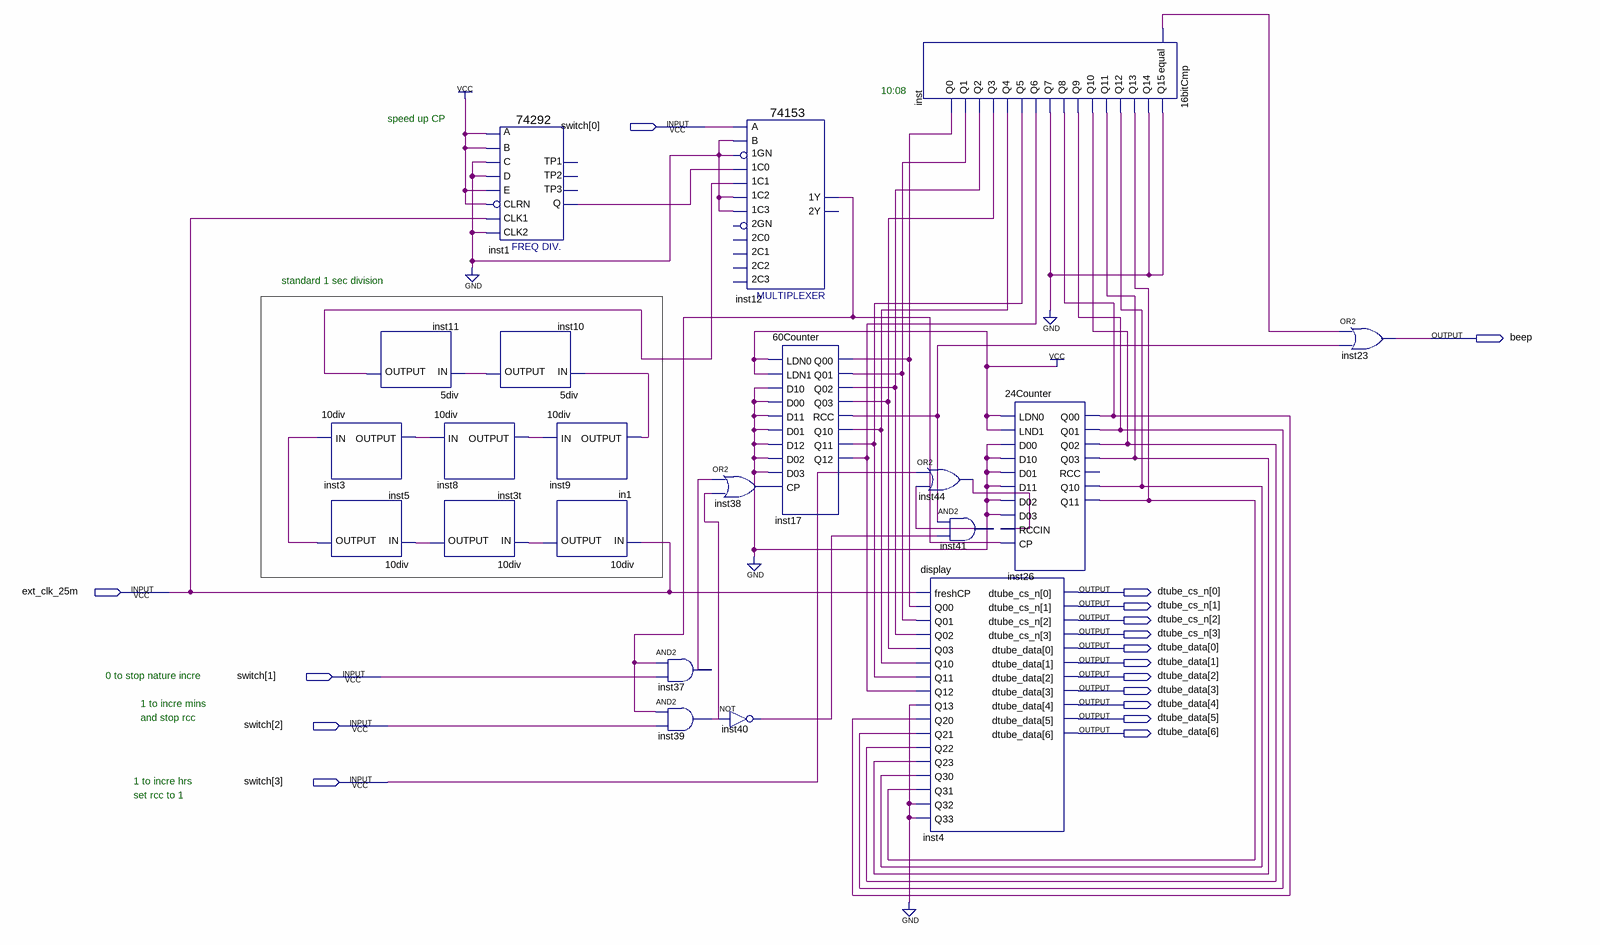
[diagram p0: schematic sheet]
// Quartus schematic alertDesign.bdf as structural Verilog: 21 symbols, 17 pins
module alertDesign (
  input  [3:0] switch,
  input  ext_clk_25m,
  output beep,
  output [3:0] dtube_cs_n,
  output [6:0] dtube_data
);

  wire in1_output, inst1_q, inst3_output, inst3t_output, inst5_output, inst8_output, inst9_output,
       inst10_output, inst11_output, inst12_1y, inst17_q00, inst17_q01, inst17_q02, inst17_q03, inst17_q10,
       inst17_q11, inst17_q12, inst17_rcc, inst26_q00, inst26_q01, inst26_q02, inst26_q03, inst26_q10,
       inst26_q11, inst37_out, inst38_out, inst39_out, inst40_out, inst41_out, inst44_out, inst_equal;

  \10div  inst3 (.IN(inst5_output), .OUTPUT(inst3_output));
  \10div  inst5 (.IN(inst3t_output), .OUTPUT(inst5_output));
  \5div  inst11 (.IN(inst10_output), .OUTPUT(inst11_output));
  \10div  inst8 (.IN(inst3_output), .OUTPUT(inst8_output));
  \10div  inst3t (.IN(in1_output), .OUTPUT(inst3t_output));
  \74292  inst1 (
    .A(1'b1), .D(1'b0), .C(1'b0), .B(1'b1), .CLK1(ext_clk_25m), .CLRN(1'b1), .E(1'b1), .CLK2(1'b0),
    .Q(inst1_q));  // open: TP2, TP1, TP3
  \5div  inst10 (.IN(inst9_output), .OUTPUT(inst10_output));
  \10div  inst9 (.IN(inst8_output), .OUTPUT(inst9_output));
  \10div  in1 (.IN(ext_clk_25m), .OUTPUT(in1_output));
  and inst37 (inst37_out, inst12_1y, switch[1]);
  and inst39 (inst39_out, inst12_1y, switch[2]);
  or inst38 (inst38_out, inst37_out, inst39_out);
  not inst40 (inst40_out, inst39_out);
  \74153  inst12 (
    .\1C1 (inst11_output), .\1GN (1'b0), .\1C0 (inst1_q), .\1C2 (1'b0), .\1C3 (1'b0), .B(1'b0),
    .A(switch[0]), .\1Y (inst12_1y));  // open: 2C0, 2GN, 2C2, 2C1, 2C3, 2Y
  \60Counter  inst17 (
    .LDN0(1'b1), .LDN1(1'b1), .D10(1'b0), .D00(1'b0), .D11(1'b0), .D01(1'b0), .D12(1'b0), .D02(1'b0),
    .D03(1'b0), .CP(inst38_out), .Q00(inst17_q00), .Q01(inst17_q01), .Q02(inst17_q02), .Q03(inst17_q03),
    .RCC(inst17_rcc), .Q10(inst17_q10), .Q11(inst17_q11), .Q12(inst17_q12));
  \16bitCmp  inst (
    .Q15(1'b0), .Q14(1'b0), .Q13(inst26_q11), .Q12(inst26_q10), .Q11(inst26_q03), .Q10(inst26_q02),
    .Q9(inst26_q01), .Q8(inst26_q00), .Q7(1'b0), .Q6(inst17_q12), .Q5(inst17_q11), .Q4(inst17_q10),
    .Q3(inst17_q03), .Q2(inst17_q02), .Q1(inst17_q01), .Q0(inst17_q00), .equal(inst_equal));
  or inst44 (inst44_out, switch[3], inst41_out);
  and inst41 (inst41_out, inst17_rcc, inst40_out);
  display inst4 (
    .freshCP(ext_clk_25m), .Q00(inst17_q00), .Q01(inst17_q01), .Q02(inst17_q02), .Q03(inst17_q03),
    .Q10(inst17_q10), .Q11(inst17_q11), .Q12(inst17_q12), .Q13(1'b0), .Q20(inst26_q00), .Q21(inst26_q01),
    .Q22(inst26_q02), .Q23(inst26_q03), .Q30(inst26_q10), .Q31(inst26_q11), .Q32(1'b0), .Q33(1'b0),
    .dtube_cs_n(dtube_cs_n), .dtube_data(dtube_data));
  \24Counter  inst26 (
    .LDN0(1'b1), .LND1(1'b1), .D00(1'b0), .D10(1'b0), .D01(1'b0), .D11(1'b0), .D02(1'b0), .D03(1'b0),
    .RCCIN(inst44_out), .CP(inst12_1y), .Q00(inst26_q00), .Q01(inst26_q01), .Q02(inst26_q02),
    .Q03(inst26_q03), .Q10(inst26_q10), .Q11(inst26_q11));  // open: RCC
  or inst23 (beep, inst_equal, inst17_rcc);

  // Notes on the sheet:
  //   10:08
  //   speed up CP
  //   standard 1 sec division
  //   0 to stop nature incre
  //   1 to incre mins
  //   and stop rcc
  //   1 to incre hrs
  //   set rcc to 1
endmodule
